# Altium schematic sheet 7_PCIeBank.SchDoc
size A; SheetNumber: 8; SheetTotal: 9
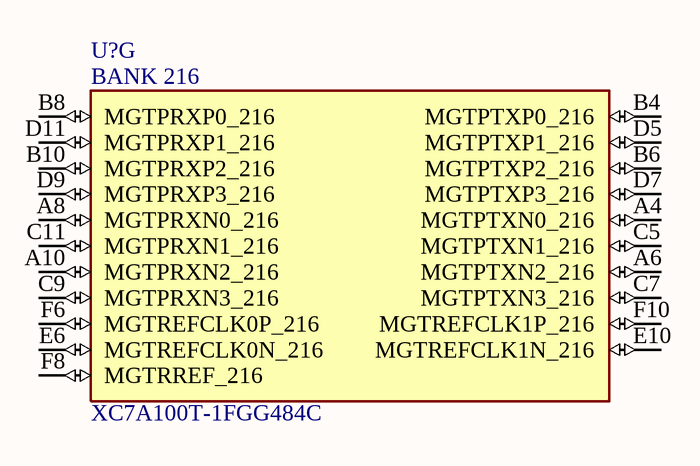
[diagram p0: 7_PCIeBank.SchDoc]

## Parts
U?  XC7A100T-1FGG484C  [BGA484C100P22X22_2300X2300X260N]  (part G of 14)

## Nets

Not connected (* = marked no-connect by the designer): U? A4(MGTPTXN0_216) A6(MGTPTXN2_216) A8(MGTPRXN0_216) A10(MGTPRXN2_216) B4(MGTPTXP0_216) B6(MGTPTXP2_216) B8(MGTPRXP0_216) B10(MGTPRXP2_216) C5(MGTPTXN1_216) C7(MGTPTXN3_216) C9(MGTPRXN3_216) C11(MGTPRXN1_216) D5(MGTPTXP1_216) D7(MGTPTXP3_216) D9(MGTPRXP3_216) D11(MGTPRXP1_216) E6(MGTREFCLK0N_216) E10(MGTREFCLK1N_216) F6(MGTREFCLK0P_216) F8(MGTRREF_216) F10(MGTREFCLK1P_216)

## Notes on the sheet
- (in symbol XC7A100T-1FGG484C, part G) BANK 216

## Library data of the parts
U? = XC7A100T-1FGG484C: Artix-7 Field Programmable Gate Array (FPGA) IC 285 4976640 101440 484-BBGA; MF: Xilinx Inc.; Value: *; Check_prices: https://www.snapeda.com/parts/XC7A100T-1FGG484C/Xilinx/view-part/?ref=eda; MP: XC7A100T-1FGG484C; SnapEDA_Link: https://www.snapeda.com/parts/XC7A100T-1FGG484C/Xilinx/view-part/?ref=snap; Package: FBGA-484 Xilinx